# Altium schematic sheet LED SMD.schdoc
size 127 x 99 mm
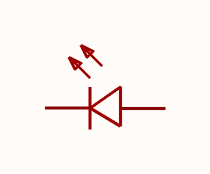
[diagram p0: LED SMD.schdoc]

## Parts
U?  XYC-IRC18C-24  [LED-SMD_L3.0-W3.0-LS3.2-RD_RED]  (value not drawn)

## Nets

Not connected (* = marked no-connect by the designer): U? 1(C) 2(A)

## Library data of the parts
U? = XYC-IRC18C-24: Manufacturer: NEWOPTO(鑫永诚光电); Add into BOM: yes; Vf - Forward Voltage: 1.4V~1.8V; Power Dissipation: 900mW; Wavelength: 940nm; Current - DC Forward (If): 500mA; Reverse Voltage: 5V; View Angle: 120°; Symbol: XYC-IRC18C-24; Device: XYC-IRC18C-24; LCSC Part Name: XYC-IRC18C-24; Supplier Part: C2988733; Manufacturer Part: XYC-IRC18C-24; Supplier Footprint: SMD3030; JLCPCB Part Class: Extended Part; Datasheet: https://atta.szlcsc.com/upload/public/pdf/source/20220415/AF6ACF3234B7CCBAD1FA94129DBDDB73.pdf; Supplier: LCSC; Convert to PCB: yes; Operating Temperature: -40℃~+85℃